# EAGLE design 192x64 (EAGLE 7.4.0)
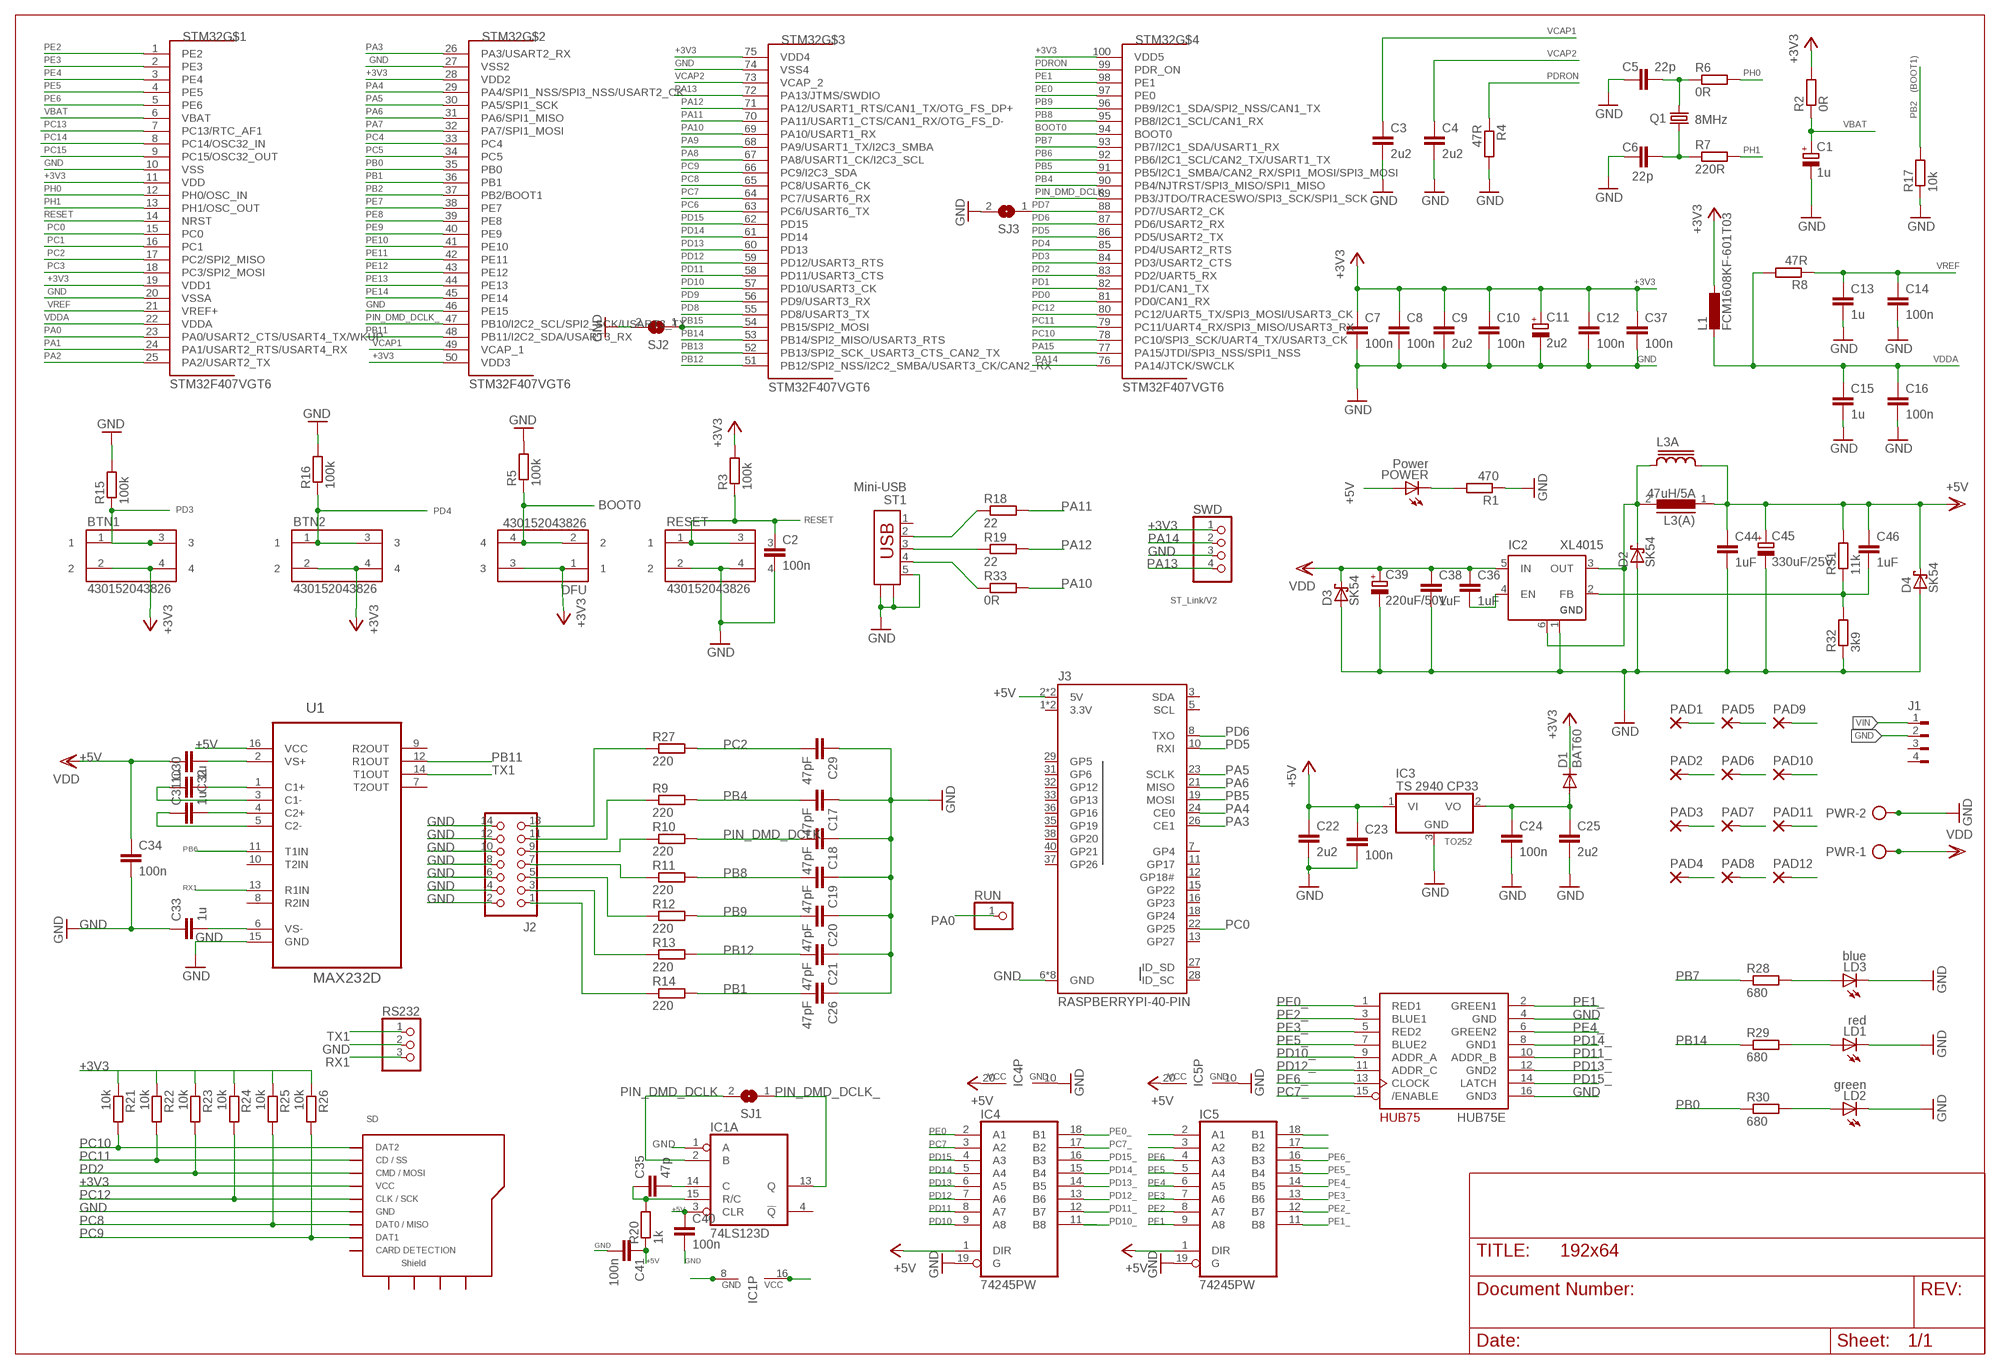
[diagram p0: schematic, sheet 1]

## Parts
BTN1  430152043826  [430152043826]
BTN2  430152043826  [430152043826]
C1  1u  CPOL-EUCT3528  [CT3528]
C2  100n  C-EUC0805  [C0805]
C3  2u2  C-EUC0805  [C0805]
C4  2u2  C-EUC0805  [C0805]
C5  22p  C-EUC0805  [C0805]
C6  22p  C-EUC0805  [C0805]
C7  100n  C-EUC0805  [C0805]
C8  100n  C-EUC0805  [C0805]
C9  2u2  C-EUC1206  [C1206]
C10  100n  C-EUC0805  [C0805]
C11  2u2  CPOL-EUCT3528  [CT3528]
C12  100n  C-EUC0805  [C0805]
C13  1u  C-EUC1206  [C1206]
C14  100n  C-EUC0805  [C0805]
C15  1u  C-EUC1206  [C1206]
C16  100n  C-EUC0805  [C0805]
C17  47pF  C-EUC0805  [C0805]
C18  47pF  C-EUC0805  [C0805]
C19  47pF  C-EUC0805  [C0805]
C20  47pF  C-EUC0805  [C0805]
C21  47pF  C-EUC0805  [C0805]
C22  2u2  C-EUC1206  [C1206]
C23  100n  C-EUC0805  [C0805]
C24  100n  C-EUC0805  [C0805]
C25  2u2  C-EUC1206  [C1206]
C26  47pF  C-EUC0805  [C0805]
C29  47pF  C-EUC0805  [C0805]
C30  1u  C-EUC0805  [C0805]
C31  1u  C-EUC0805  [C0805]
C32  1u  C-EUC0805  [C0805]
C33  1u  C-EUC0805  [C0805]
C34  100n  C-EUC0805  [C0805]
C35  47p  C-EUC0805  [C0805]
C36  1uF  C-EUC1206  [C1206]
C37  100n  C-EUC0805  [C0805]
C38  1uF  C-EUC1206  [C1206]
C39  220uF/50V  CPOL-EUG  [PANASONIC_G]
C40  100n  C-EUC0805  [C0805]
C41  100n  C-EUC0805  [C0805]
C44  1uF  C-EUC1206  [C1206]
C45  330uF/25V  CPOL-EUG  [PANASONIC_G]
C46  1uF  C-EUC1206  [C1206]
D1  BAT60  DIODE-SOD323-W  [SOD323-W]
D2  SK54  SCHOTTKY-DIODESMD  [SMB]
D3  SK54  SCHOTTKY-DIODESMD  [SMB]
D4  SK54  SCHOTTKY-DIODESMD  [SMB]
DFU  430152043826  [430152043826]
HUB75E  RGB  HUB75MATRIX  [2X08-IDC]
IC1  74LS123D  [SO16]
IC2  XL4015  [TO263-5]
IC3  TS 2940 CP33  7808DT  [TO252]
IC4  74245PW  [TSSOP20]
IC5  74245PW  [TSSOP20]
J1  FLOPPY-4  [FLOPPY-4]
J2  CON_HEADER_2X07-PTH-SHROUDED  [PINSHRD_PTH_2X07]
J3  RASPBERRYPI-40-PIN  RASPBERRYPI-40-PIN-GPIO_PTH_NO_SHROUD  [2X20]
L1  FCM1608KF-601T03  L-EUL2012C  [L2012C]
L3(A)  47uH/5A  ED16  [ED16]
L3A  SRR1206  [SRR1206]
LD1  red  LEDCHIP-LED0805  [CHIP-LED0805]
LD2  green  LEDCHIP-LED0805  [CHIP-LED0805]
LD3  blue  LEDCHIP-LED0805  [CHIP-LED0805]
PAD1  SMD5  [SMD2,54-5,08]
PAD2  SMD5  [SMD2,54-5,08]
PAD3  SMD5  [SMD2,54-5,08]
PAD4  SMD5  [SMD2,54-5,08]
PAD5  SMD5  [SMD2,54-5,08]
PAD6  SMD5  [SMD2,54-5,08]
PAD7  SMD5  [SMD2,54-5,08]
PAD8  SMD5  [SMD2,54-5,08]
PAD9  SMD5  [SMD2,54-5,08]
PAD10  SMD5  [SMD2,54-5,08]
PAD11  SMD5  [SMD2,54-5,08]
PAD12  SMD5  [SMD2,54-5,08]
POWER  Power  LEDCHIPLED_0805  [CHIPLED_0805]
PWR  AK500/2-H  [AK500/2-H]
Q1  8MHz  CRYSTALHC49UP  [HC49UP]
R1  470  R-EU_R0805  [R0805]
R2  0R  R-EU_R0805  [R0805]
R3  100k  R-EU_R0805  [R0805]
R4  47R  R-EU_R0805  [R0805]
R5  100k  R-EU_R0805  [R0805]
R6  0R  R-EU_R0805  [R0805]
R7  220R  R-EU_R0805  [R0805]
R8  47R  R-EU_R0805  [R0805]
R9  220  R-EU_R0805  [R0805]
R10  220  R-EU_R0805  [R0805]
R11  220  R-EU_R0805  [R0805]
R12  220  R-EU_R0805  [R0805]
R13  220  R-EU_R0805  [R0805]
R14  220  R-EU_R0805  [R0805]
R15  100k  R-EU_R0805  [R0805]
R16  100k  R-EU_R0805  [R0805]
R17  10k  R-EU_R0805  [R0805]
R18  22  R-EU_R0805  [R0805]
R19  22  R-EU_R0805  [R0805]
R20  1k  R-EU_R0805  [R0805]
R21  10k  R-EU_R0805  [R0805]
R22  10k  R-EU_R0805  [R0805]
R23  10k  R-EU_R0805  [R0805]
R24  10k  R-EU_R0805  [R0805]
R25  10k  R-EU_R0805  [R0805]
R26  10k  R-EU_R0805  [R0805]
R27  220  R-EU_R0805  [R0805]
R28  680  R-EU_R0805  [R0805]
R29  680  R-EU_R0805  [R0805]
R30  680  R-EU_R0805  [R0805]
R31  11k  R-EU_R1206  [R1206]
R32  3k9  R-EU_R1206  [R1206]
R33  0R  R-EU_R0805  [R0805]
RESET  430152043826  [430152043826]
RS232  PINHD-1X3  [1X03]
RUN  PINHD-1X1  [1X01]
SD  MICROSD_CARD_POLLIN  [MR**-AP*03**]
SJ1  SJ  [SJ]
SJ2  SJ  [SJ]
SJ3  SJ  [SJ]
ST1  Mini-USB  UBS-MINI  [USBMINI]
STM32  STM32F407VGT6  STM32F407VX  [LQFP100]
SWD  PINHD-1X4  [1X04]
U1  MAX232D  [SOIC127P600X175-16N]

## Nets
+3V3: BTN1.2 BTN1.4 BTN2.2 BTN2.4 C7.1 C8.1 C9.1 C10.1 C11.+ C12.1 C37.1 D1.C DFU.1 DFU.3 L1.1 R2.2 R3.2 R21.1 R22.1 R23.1 R24.1 R25.1 R26.1 SD.VCC STM32.11(VDD) STM32.19(VDD1) STM32.28(VDD2) STM32.50(VDD3) STM32.75(VDD4) STM32.100(VDD5) SWD.1
+5V: C22.1 C23.1 C32.2 C34.1 C40.1 C41.1 C44.1 C45.+ C46.1 D4.C IC1.3(A:CLR) IC1.16(P:VCC) IC3.1(VI) IC4.1(DIR) IC4.20(VCC) IC5.1(DIR) IC5.20(VCC) J3.2(5V) J3.4(5V) L3(A).1 L3A.2 PAD1.1(P) PAD2.1(P) PAD5.1(P) PAD6.1(P) PAD9.1(P) PAD10.1(P) POWER.A R20.1 R31.2 U1.16(VCC) ; supply symbol labelled VDD
BOOT0: DFU.2 DFU.4 R5.1 STM32.94(BOOT0)
GND: C1.- C2.2 C3.2 C4.2 C5.2 C6.2 C7.2 C8.2 C9.2 C10.2 C11.- C12.2 C13.2 C14.2 C15.2 C16.2 C17.1 C18.1 C19.1 C20.1 C21.1 C22.2 C23.2 C24.2 C25.2 C26.1 C29.1 C33.1 C34.2 C37.2 C38.2 C39.- C40.2 C41.2 C44.2 C45.- D2.A D3.A D4.A HUB75E.4(GND) HUB75E.16(GND3) IC1.1(A:A) IC1.8(P:GND) IC2.1(GND) IC3.3(GND) IC4.10(GND) IC4.19(G) IC5.2(A1) IC5.3(A2) IC5.10(GND) IC5.19(G) J1.2 J2.2 J2.4 J2.6 J2.8 J2.10 J2.12 J2.14 J3.6(GND) J3.9(GND) J3.14(GND) J3.20(GND) J3.25(GND) J3.30(GND) J3.34(GND) J3.39(GND) LD1.C LD2.C LD3.C PAD3.1(P) PAD4.1(P) PAD7.1(P) PAD8.1(P) PAD11.1(P) PAD12.1(P) PWR.2 R1.1 R4.2 R5.2 R15.2 R16.2 R17.1 R32.1 RESET.2 RESET.4 RS232.2 SD.GND SJ2.2 SJ3.2 ST1.5 ST1.N1 ST1.N2 STM32.10(VSS) STM32.20(VSSA) STM32.27(VSS2) STM32.46(PE15) STM32.74(VSS4) SWD.3 U1.15(GND)
N$1: C5.1 Q1.2 R6.1
N$2: C6.1 Q1.1 R7.1
N$3: POWER.C R1.2
N$4: J2.13 R27.1
N$5: J2.11 R9.1
N$6: J2.9 R10.1
N$7: J2.7 R11.1
N$8: J2.5 R12.1
N$9: J2.3 R13.1
N$10: C35.1 IC1.15(A:R/C) R20.2
N$11: J2.1 R14.1
N$12: C24.1 C25.1 D1.A IC3.2(VO)
N$13: C30.2 U1.1(C1+)
N$14: C30.1 U1.3(C1-)
N$15: C31.2 U1.4(C2+)
N$16: C31.1 U1.5(C2-)
N$17: C33.2 U1.6(VS-)
N$18: C32.1 U1.2(VS+)
N$19: LD1.A R29.2
N$20: D2.C IC2.3(OUT) IC2.6(TAB) L3(A).2 L3A.1
N$21: C46.2 IC2.2(FB) R31.1 R32.2
N$22: C35.2 IC1.14(A:C)
N$23: LD3.A R28.2
N$24: C36.2 IC2.4(EN)
N$25: R33.1 ST1.4
N$26: LD2.A R30.2
N$39: R19.1 ST1.3
N$40: R18.1 ST1.2
N$62: IC5.18(B1)
N$63: IC5.17(B2)
PA0: RUN.1 STM32.23(PA0/USART2_CTS/USART4_TX/WKUP)
PA1: STM32.24(PA1/USART2_RTS/USART4_RX)
PA2: STM32.25(PA2/USART2_TX)
PA3: J3.26(CE1) STM32.26(PA3/USART2_RX)
PA4: J3.24(CE0) STM32.29(PA4/SPI1_NSS/SPI3_NSS/USART2_CK)
PA5: J3.23(SCLK) STM32.30(PA5/SPI1_SCK)
PA6: J3.21(MISO) STM32.31(PA6/SPI1_MISO)
PA7: STM32.32(PA7/SPI1_MOSI)
PA8: STM32.67(PA8/USART1_CK/I2C3_SCL)
PA9: STM32.68(PA9/USART1_TX/I2C3_SMBA)
PA10: R33.2 STM32.69(PA10/USART1_RX)
PA11: R18.2 STM32.70(PA11/USART1_CTS/CAN1_RX/OTG_FS_D-)
PA12: R19.2 STM32.71(PA12/USART1_RTS/CAN1_TX/OTG_FS_DP+)
PA13: STM32.72(PA13/JTMS/SWDIO) SWD.4
PA14: STM32.76(PA14/JTCK/SWCLK) SWD.2
PA15: STM32.77(PA15/JTDI/SPI3_NSS/SPI1_NSS)
PB0: R30.1 STM32.35(PB0)
PB1: C26.2 R14.2 STM32.36(PB1)
PB2: R17.2 STM32.37(PB2/BOOT1)
PB4: C17.2 R9.2 STM32.90(PB4/NJTRST/SPI3_MISO/SPI1_MISO)
PB5: J3.19(MOSI) STM32.91(PB5/I2C1_SMBA/CAN2_RX/SPI1_MOSI/SPI3_MOSI)
PB6: STM32.92(PB6/I2C1_SCL/CAN2_TX/USART1_TX) U1.11(T1IN)
PB7: R28.1 STM32.93(PB7/I2C1_SDA/USART1_RX)
PB8: C19.2 R11.2 STM32.95(PB8/I2C1_SCL/CAN1_RX)
PB9: C20.2 R12.2 STM32.96(PB9/I2C1_SDA/SPI2_NSS/CAN1_TX)
PB11: STM32.48(PB11/I2C2_SDA/USART3_RX) U1.12(R1OUT)
PB12: C21.2 R13.2 STM32.51(PB12/SPI2_NSS/I2C2_SMBA/USART3_CK/CAN2_RX)
PB13: STM32.52(PB13/SPI2_SCK_USART3_CTS_CAN2_TX)
PB14: R29.1 STM32.53(PB14/SPI2_MISO/USART3_RTS)
PB15: SJ2.1 STM32.54(PB15/SPI2_MOSI)
PC0: J3.22(GP25) STM32.15(PC0)
PC1: STM32.16(PC1)
PC2: C29.2 R27.2 STM32.17(PC2/SPI2_MISO)
PC3: STM32.18(PC3/SPI2_MOSI)
PC4: STM32.33(PC4)
PC5: STM32.34(PC5)
PC6: STM32.63(PC6/USART6_TX)
PC7: IC4.3(A2) STM32.64(PC7/USART6_RX)
PC7_: HUB75E.15(/ENABLE) IC4.17(B2)
PC8: R25.2 SD.DAT0(DAT0/MISO) STM32.65(PC8/USART6_CK)
PC9: R26.2 SD.DAT1 STM32.66(PC9/I2C3_SDA)
PC10: R21.2 SD.DAT2 STM32.78(PC10/SPI3_SCK/UART4_TX/USART3_CK)
PC11: R22.2 SD.DAT3/CS(CD/SS) STM32.79(PC11/UART4_RX/SPI3_MISO/USART3_RX)
PC12: R24.2 SD.CLK(CLK/SCK) STM32.80(PC12/UART5_TX/SPI3_MOSI/USART3_CK)
PC13: STM32.7(PC13/RTC_AF1)
PC14: STM32.8(PC14/OSC32_IN)
PC15: STM32.9(PC15/OSC32_OUT)
PD0: STM32.81(PD0/CAN1_RX)
PD1: STM32.82(PD1/CAN1_TX)
PD2: R23.2 SD.CMD(CMD/MOSI) STM32.83(PD2/UART5_RX)
PD3: BTN1.1 BTN1.3 R15.1 STM32.84(PD3/USART2_CTS)
PD4: BTN2.1 BTN2.3 R16.1 STM32.85(PD4/USART2_RTS)
PD5: J3.10(RXI) STM32.86(PD5/USART2_TX)
PD6: J3.8(TXO) STM32.87(PD6/USART2_RX)
PD7: SJ3.1 STM32.88(PD7/USART2_CK)
PD8: STM32.55(PD8/USART3_TX)
PD9: STM32.56(PD9/USART3_RX)
PD10: IC4.9(A8) STM32.57(PD10/USART3_CK)
PD10_: HUB75E.9(ADDR_A) IC4.11(B8)
PD11: IC4.8(A7) STM32.58(PD11/USART3_CTS)
PD11_: HUB75E.10(ADDR_B) IC4.12(B7)
PD12: IC4.7(A6) STM32.59(PD12/USART3_RTS)
PD12_: HUB75E.11(ADDR_C) IC4.13(B6)
PD13: IC4.6(A5) STM32.60(PD13)
PD13_: HUB75E.12(GND2) IC4.14(B5)
PD14: IC4.5(A4) STM32.61(PD14)
PD14_: HUB75E.8(GND1) IC4.15(B4)
PD15: IC4.4(A3) STM32.62(PD15)
PD15_: HUB75E.14(LATCH) IC4.16(B3)
PDRON: R4.1 STM32.99(PDR_ON)
PE0: IC4.2(A1) STM32.97(PE0)
PE0_: HUB75E.1(RED1) IC4.18(B1)
PE1: IC5.9(A8) STM32.98(PE1)
PE1_: HUB75E.2(GREEN1) IC5.11(B8)
PE2: IC5.8(A7) STM32.1(PE2)
PE2_: HUB75E.3(BLUE1) IC5.12(B7)
PE3: IC5.7(A6) STM32.2(PE3)
PE3_: HUB75E.5(RED2) IC5.13(B6)
PE4: IC5.6(A5) STM32.3(PE4)
PE4_: HUB75E.6(GREEN2) IC5.14(B5)
PE5: IC5.5(A4) STM32.4(PE5)
PE5_: HUB75E.7(BLUE2) IC5.15(B4)
PE6: IC5.4(A3) STM32.5(PE6)
PE6_: HUB75E.13(CLOCK) IC5.16(B3)
PE7: STM32.38(PE7)
PE8: STM32.39(PE8)
PE9: STM32.40(PE9)
PE10: STM32.41(PE10)
PE11: STM32.42(PE11)
PE12: STM32.43(PE12)
PE13: STM32.44(PE13)
PE14: STM32.45(PE14)
PH0: R6.2 STM32.12(PH0/OSC_IN)
PH1: R7.2 STM32.13(PH1/OSC_OUT)
PIN_DMD_DCLK: C18.2 IC1.2(A:B) R10.2 SJ1.2
PIN_DMD_DCLK_: IC1.13(A:Q) SJ1.1 STM32.47(PB10/I2C2_SCL/SPI2_SCK/USART3_TX) STM32.89(PB3/JTDO/TRACESWO/SPI3_SCK/SPI1_SCK)
RESET: C2.1 R3.1 RESET.1 RESET.3 STM32.14(NRST)
RX1: RS232.3 U1.13(R1IN)
TX1: RS232.1 U1.14(T1OUT)
VBAT: C1.+ R2.1 STM32.6(VBAT)
VCAP1: C3.1 STM32.49(VCAP_1)
VCAP2: C4.1 STM32.73(VCAP_2)
VDDA: C15.1 C16.1 L1.2 R8.2 STM32.22(VDDA)
VIN: C36.1 C38.1 C39.+ D3.C IC2.5(IN) J1.1 PWR.1 ; supply symbol labelled VDD
VREF: C13.1 C14.1 R8.1 STM32.21(VREF+)
Unconnected: IC1.4(A:!Q) IC1.5(B:Q) IC1.6(B:C) IC1.7(B:R/C) IC1.9(B:A) IC1.10(B:B) IC1.11(B:CLR) IC1.12(B:!Q) J1.3 J1.4 J3.3(SDA) J3.5(SCL) J3.7(GP4) J3.11(GP17) J3.12(GP18#) J3.13(GP27) J3.15(GP22) J3.16(GP23) J3.18(GP24) J3.27(ID_SD) J3.28(ID_SC) J3.29(GP5) J3.31(GP6) J3.32(GP12) J3.33(GP13) J3.35(GP19) J3.36(GP16) J3.37(GP26) J3.38(GP20) J3.40(GP21) SD.CARD_DETECTION(CARD_D) SD.SHD_1(SHD1) SD.SHD_2(SHD2) SD.SHD_3(SHD3) SD.SHD_4(SHD4) ST1.1 U1.7(T2OUT) U1.8(R2IN) U1.9(R2OUT) U1.10(T2IN)

## Notes on the sheet
- (BOOT1)
- ST_Link/V2
- TO252

## Power pins joined to a net without a drawn wire
3.3V: J3.1(3.3V) J3.17(3.3V)

## Library data of the parts
BTN1 BTN2 DFU RESET = Switches_rev16a:430152043826: WS-TSS-6x6 mm SMD Tact Switch,4 pins
C1 C11 = rcl:CPOL-EU: POLARIZED CAPACITOR, European symbol
C2 C5-C8 C10 C12 C16 C23 C24 C37 = rcl:C-EU: CAPACITOR, European symbol
C3 C4 C9 C13-C15 C17-C22 C25 C26 C29-C36 C38 C40 C41 C44 C46 = resistor:C-EU: CAPACITOR, European symbol
C39 C45 = resistor:CPOL-EU: POLARIZED CAPACITOR, European symbol
D1 = diode:DIODE-: DIODE
D2-D4 = diode:SCHOTTKY-DIODE: Schottky Diode
HUB75E = adafruit:HUB75MATRIX
IC1 = 74xx-eu:74*123: Retriggerable monostable MULTIVIBRATOR
IC2 = linear4:XL4015
IC3 = linear:78*: Positive VOLTAGE REGULATOR Source: http://cache.national.com/ds/LM/LM78L05.pdf http://www.fairchildsemi.com/ds/LM/LM7805.pdf
IC4 IC5 = 74xx-eu:74*245: Octal BUS TRANSCEIVER, 3-state
J1 = con-amp:FLOPPY-4: MATE N-LOCK Floppy / HDD conector Distributor: Bürklin 71F970
J2 = dp_devices.v6:CON_HEADER_2X07: 2x07 pin header
J3 = SparkFun-Connectors:RASPBERRYPI-40-PIN-GPIO: Raspberry Pi GPIO Header 2x20 pin connector, as found on B, B+, A+ models. Both shrouded PTH and SMT versions available. SparkFun Products: GPIO Shrouded Header <https://www.sparkfun.com/products/13054>- PTH SparkFun Pi Wedge (Preassembled) <https://www.sparkfun.com/products/13717>
L1 = rcl:L-EU: INDUCTOR, European symbol
L3(A) = inductors:ED16: INDUCTOR
L3A = inductor-bourns:SRR1206: POWER INDUCTOR
LD1-LD3 = adafruit:LED: LED
PAD1-PAD12 = wirepad:SMD5: SMD PAD
POWER = led:LED: LED
PWR = con-ptr500:AK500/2-H: CONNECTOR Aug. 2004 / PTR Meßtechnik: Die Bezeichnung der Serie AK505 wurde geändert. Es handelt sich hierbei um AK500 in horizontaler Ausführung.; OC_FARNELL: unknown; OC_NEWARK: unknown
Q1 = crystal:CRYSTAL: CRYSTAL; OC_FARNELL: unknown; OC_NEWARK: unknown
R1 R2 R4 R6-R8 R17 R20 = rcl:R-EU_: RESISTOR, European symbol
R3 R5 R9-R16 R18 R19 R21-R33 = resistor:R-EU_: RESISTOR, European symbol
RS232 = pinhead:PINHD-1X3: PIN HEADER
RUN = pinhead:PINHD-1X1: PIN HEADER
SD = 000_eigene_Bauteile:MICROSD_CARD_POLLIN
SJ1-SJ3 = jumper:SJ: SMD solder JUMPER
ST1 = con-amp:UBS-MINI
STM32 = STM32F407Vx_LQFP100:STM32F407VX: STmicroelectronics Cortex M4 Series Typ: STM32F407Vx LQFP100 Copyright 2012 by Ersan Günes, Quantitec, info@quantitec.de
SWD = pinhead:PINHD-1X4: PIN HEADER
U1 = MAX232D:MAX232D: DUAL EIA-232 DRIVERS/RECEIVERS

## Board
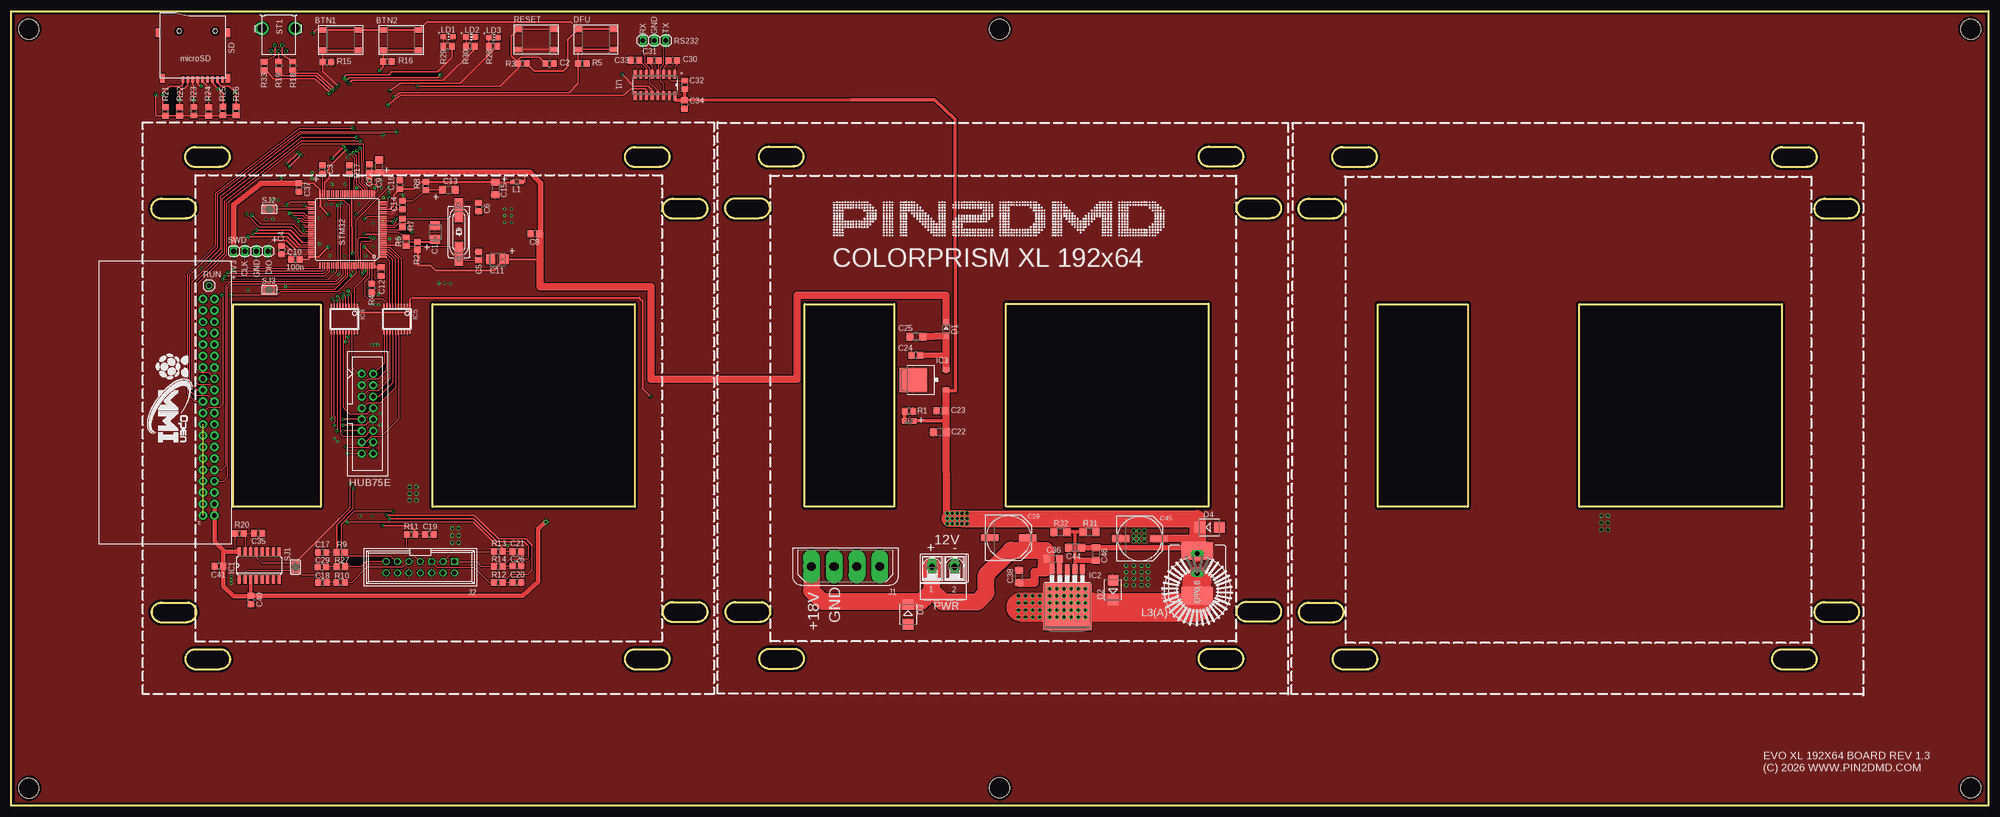
[diagram p1: board, top side]
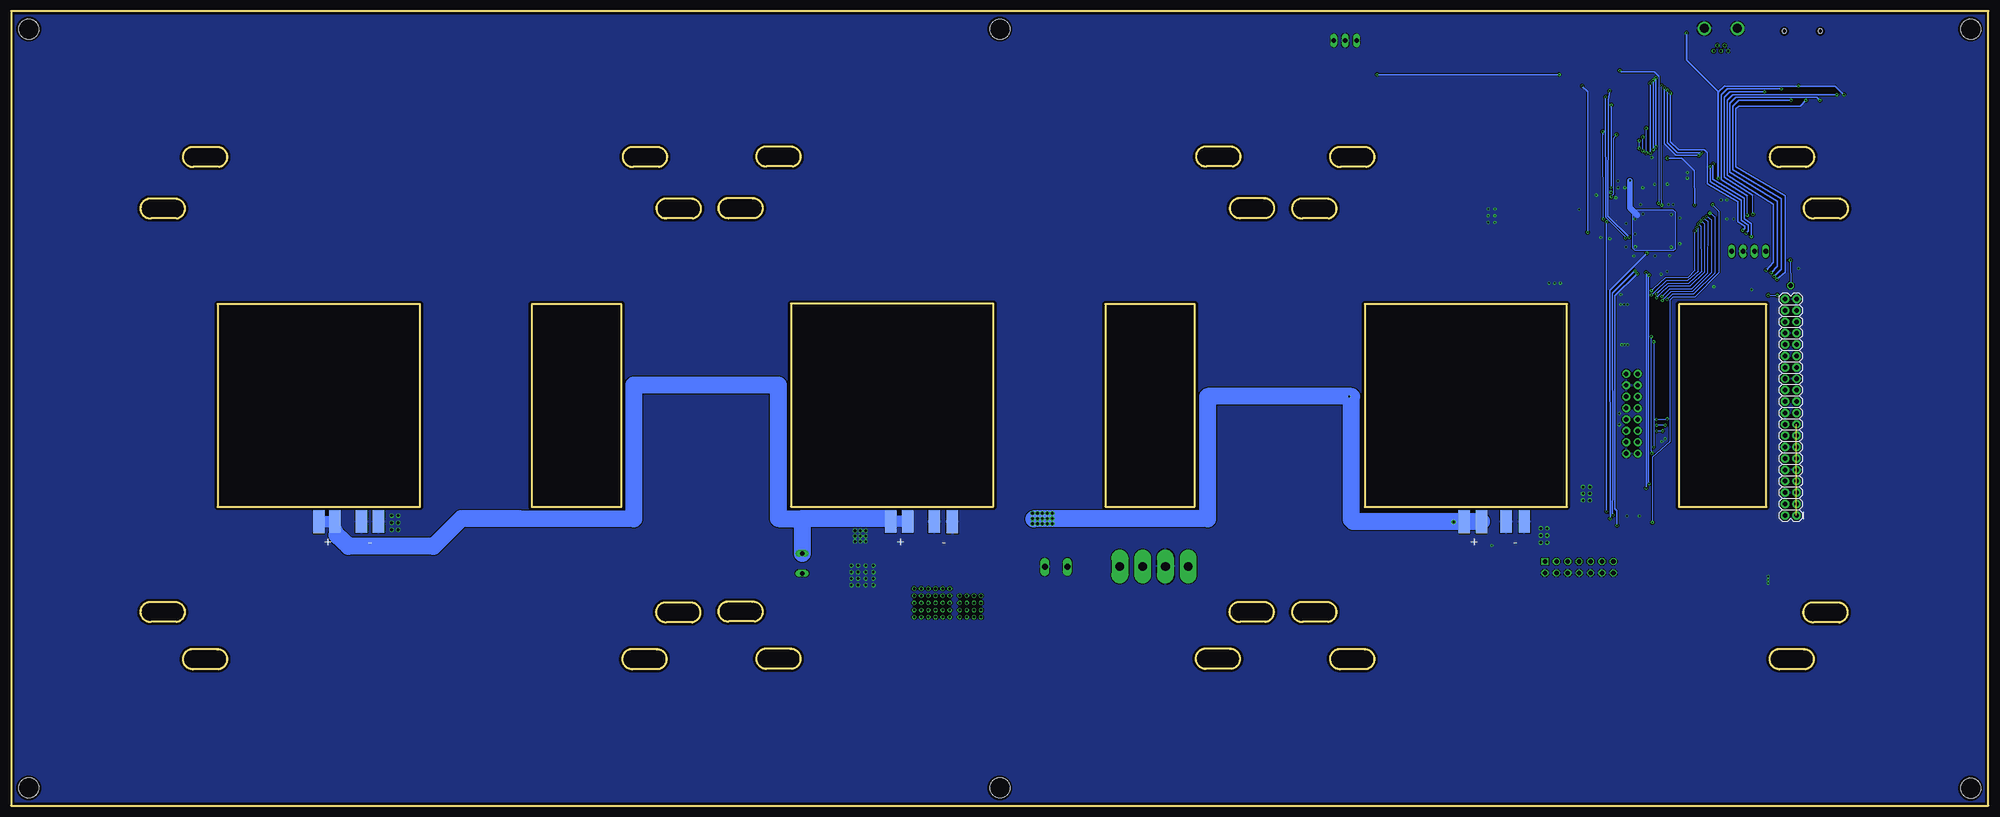
[diagram p2: board, bottom side, seen from below]

Size 441.07 x 177.19 mm. Coordinates in mm from the lower left corner, seen from the top.
Outline: 144 segments
Copper layers (1*16): Top 0.035mm / dielectric 1.6mm / Bottom 0.035mm
Design rules "Elecrow_2-layer_PCB_eagle_rule *": minimum track width 6mil, minimum drill 12mil, track to track 8mil, track to pad 6mil, pad to pad 6mil, via to via 8mil, smd to smd 0mil, copper to edge 20mil, drill to drill 10mil, minimum pad ring 6mil, minimum via ring 6mil, stop-mask expansion 0mil, vias tented up to drill 100mil, thermal gap 10mil
Holes 4.5 mm at 3.95,173.19 220.51,173.19 437.15,173.19 437.15,3.96 220.51,3.96 3.95,3.88

### Footprints (pad centres in the part's own frame; a part is rotated, then mirrored left to right if it is on the bottom)
430152043826 = smd 1.55 x 1.3: 1 -3.975,2.25; 2 -3.975,-2.25; 3 3.975,2.25; 4 3.975,-2.25
CT3528 = smd 2 x 2.2: + -1.5,0; - 1.5,0
C0805 = smd 1.3 x 1.5: 1 -0.95,0; 2 0.95,0
C1206 = smd 1.6 x 1.8: 1 -1.4,0; 2 1.4,0
PANASONIC_G = smd 3.9 x 1.6: + 4.25,0; - -4.25,0
SOD323-W = smd 1.5 x 1.2: A 1.45,0; C -1.45,0
SMB = smd 2.4 x 2.4: A 2.2,0; C -2.2,0
2X08-IDC = drill 1 pad 1.778: 1 -1.27,8.89; 2 1.27,8.89; 3 -1.27,6.35; 4 1.27,6.35; 5 -1.27,3.81; 6 1.27,3.81; 7 -1.27,1.27; 8 1.27,1.27; 9 -1.27,-1.27; 10 1.27,-1.27; 11 -1.27,-3.81; 12 1.27,-3.81; 13 -1.27,-6.35; 14 1.27,-6.35; 15 -1.27,-8.89; 16 1.27,-8.89
SO16 = smd 0.66 x 2.032: 1 -4.445,-3.073; 2 -3.175,-3.073; 3 -1.905,-3.073; 4 -0.635,-3.073; 5 0.635,-3.073; 6 1.905,-3.073; 7 3.175,-3.073; 8 4.445,-3.073; 9 4.445,3.073; 10 3.175,3.073; 11 1.905,3.073; 12 0.635,3.073; 13 -0.635,3.073; 14 -1.905,3.073; 15 -3.175,3.073; 16 -4.445,3.073
TO263-5 = smd 1.067 x 2.159: 1 -3.404,-5.791; 2 -1.702,-5.791; 3 0,-5.791; 4 1.702,-5.791; 5 3.404,-5.791 | smd 10.8 x 10.41: 6 0,2.54
TO252 = smd 1 x 1.6: 1 -2.28,-4.8; 2 2.28,-4.8 | smd 5.4 x 6.2: 3 0,2.5
TSSOP20 = smd 0.305 x 0.991: 1 -2.925,-2.918; 2 -2.275,-2.918; 3 -1.625,-2.918; 4 -0.975,-2.918; 5 -0.325,-2.918; 6 0.325,-2.918; 7 0.975,-2.918; 8 1.625,-2.918; 9 2.275,-2.918; 10 2.925,-2.918; 11 2.925,2.918; 12 2.275,2.918; 13 1.625,2.918; 14 0.975,2.918; 15 0.325,2.918; 16 -0.325,2.918; 17 -0.975,2.918; 18 -1.625,2.918; 19 -2.275,2.918; 20 -2.925,2.918
FLOPPY-4 = drill 1.93 pad 3.81 long: 1 7.62,0; 2 2.54,0; 3 -2.54,0; 4 -7.62,0
PINSHRD_PTH_2X07 = drill 1.016 square: 1 -7.62,-1.27 | drill 1.016 octagon: 2 -7.62,1.27; 3 -5.08,-1.27; 4 -5.08,1.27; 5 -2.54,-1.27; 6 -2.54,1.27; 7 0,-1.27; 8 0,1.27; 9 2.54,-1.27; 10 2.54,1.27; 11 5.08,-1.27; 12 5.08,1.27; 13 7.62,-1.27; 14 7.62,1.27
2X20 = drill 1.016 pad 1.88: 1 0,0; 2 0,2.54; 3 2.54,0; 4 2.54,2.54; 5 5.08,0; 6 5.08,2.54; 7 7.62,0; 8 7.62,2.54; 9 10.16,0; 10 10.16,2.54; 11 12.7,0; 12 12.7,2.54; 13 15.24,0; 14 15.24,2.54; 15 17.78,0; 16 17.78,2.54; 17 20.32,0; 18 20.32,2.54; 19 22.86,0; 20 22.86,2.54; 21 25.4,0; 22 25.4,2.54; 23 27.94,0; 24 27.94,2.54; 25 30.48,0; 26 30.48,2.54; 27 33.02,0; 28 33.02,2.54; 29 35.56,0; 30 35.56,2.54; 31 38.1,0; 32 38.1,2.54; 33 40.64,0; 34 40.64,2.54; 35 43.18,0; 36 43.18,2.54; 37 45.72,0; 38 45.72,2.54; 39 48.26,0; 40 48.26,2.54
L2012C = smd 1 x 1: 1 -1,0; 2 1,0
ED16 = drill 1.016 long: 1 -8.255,0; 2 -3.81,0
SRR1206 = smd 4 x 7: 1 -5,0; 2 5,0
CHIP-LED0805 = smd 1.2 x 1.2: A 0,-1.05; C 0,1.05
SMD2,54-5,08 = smd 2.54 x 5.08: 1 0,0
CHIPLED_0805 = smd 1.2 x 1.2: A 0,-1.05; C 0,1.05
AK500/2-H = drill 1.321 long: 1 -2.515,0; 2 2.515,0
HC49UP = smd 5.334 x 1.93: 1 -4.826,0; 2 4.826,0
R0805 = smd 1.3 x 1.5: 1 -0.95,0; 2 0.95,0
R1206 = smd 1.6 x 1.803: 1 -1.422,0; 2 1.422,0
1X03 = drill 1.016 long: 1 -2.54,0; 2 0,0; 3 2.54,0
1X01 = drill 1.016 octagon: 1 0,0
MR**-AP*03** = smd 0.6 x 1.5: CARD_DETECTION -6.55,0.3; CLK -2.15,0.3; CMD 0.05,0.3; DAT0 -4.35,0.3; DAT1 -5.45,0.3; DAT2 2.25,0.3; DAT3/CS 1.15,0.3; GND -3.25,0.3; VCC -1.05,0.3 | smd 1 x 2: SHD_1 -7.85,0; SHD_2 6.85,0; SHD_3 -7.85,-10.1; SHD_4 7.85,-10.1 | hole 1: -4.95,-10.5; 3.05,-10.5
SJ = smd 1.168 x 1.6: 1 -0.762,0; 2 0.762,0
USBMINI = drill 0.5: 1 -1.6,3; 2 -0.8,1.8; 3 0,3; 4 0.8,1.8; 5 1.6,3 | drill 2: N1 -3.7,-2; N2 3.7,-2
LQFP100 = smd 1.5 x 0.4: 1 -8,6.075; 25 -8,-6.075; 51 8,-6.075; 75 8,6.075 | smd 1.5 x 0.25: 2 -8,5.5; 3 -8,5; 4 -8,4.5; 5 -8,4; 6 -8,3.5; 7 -8,3; 8 -8,2.5; 9 -8,2; 10 -8,1.5; 11 -8,1; 12 -8,0.5; 13 -8,0; 14 -8,-0.5; 15 -8,-1; 16 -8,-1.5; 17 -8,-2; 18 -8,-2.5; 19 -8,-3; 20 -8,-3.5; 21 -8,-4; 22 -8,-4.5; 23 -8,-5; 24 -8,-5.5; 52 8,-5.5; 53 8,-5; 54 8,-4.5; 55 8,-4; 56 8,-3.5; 57 8,-3; 58 8,-2.5; 59 8,-2; 60 8,-1.5; 61 8,-1; 62 8,-0.5; 63 8,0; 64 8,0.5; 65 8,1; 66 8,1.5; 67 8,2; 68 8,2.5; 69 8,3; 70 8,3.5; 71 8,4; 72 8,4.5; 73 8,5; 74 8,5.5 | smd 0.4 x 1.5: 26 -6.075,-8; 50 6.075,-8; 76 6.075,8; 100 -6.075,8 | smd 0.25 x 1.5: 27 -5.5,-8; 28 -5,-8; 29 -4.5,-8; 30 -4,-8; 31 -3.5,-8; 32 -3,-8; 33 -2.5,-8; 34 -2,-8; 35 -1.5,-8; 36 -1,-8; 37 -0.5,-8; 38 0,-8; 39 0.5,-8; 40 1,-8; 41 1.5,-8; 42 2,-8; 43 2.5,-8; 44 3,-8; 45 3.5,-8; 46 4,-8; 47 4.5,-8; 48 5,-8; 49 5.5,-8; 77 5.5,8; 78 5,8; 79 4.5,8; 80 4,8; 81 3.5,8; 82 3,8; 83 2.5,8; 84 2,8; 85 1.5,8; 86 1,8; 87 0.5,8; 88 0,8; 89 -0.5,8; 90 -1,8; 91 -1.5,8; 92 -2,8; 93 -2.5,8; 94 -3,8; 95 -3.5,8; 96 -4,8; 97 -4.5,8; 98 -5,8; 99 -5.5,8
1X04 = drill 1.016 long: 1 -3.81,0; 2 -1.27,0; 3 1.27,0; 4 3.81,0
SOIC127P600X175-16N = smd 2.057 x 0.61: 1 -4.801,8.89; 2 -4.801,7.62; 3 -4.801,6.35; 4 -4.801,5.08; 5 -4.801,3.81; 6 -4.801,2.54; 7 -4.801,1.27; 8 -4.801,0; 9 0,0; 10 0,1.27; 11 0,2.54; 12 0,3.81; 13 0,5.08; 14 0,6.35; 15 0,7.62; 16 0,8.89

### Placement (x,y rotation side)
BTN1  73.47,170.75 180 top
BTN2  86.96,170.75 180 top
C1  94.57,127.82 90 top
C2  120.13,165.51 0 top
C3  69.43,141.9 90 top
C4  60.3,123.9 270 top
C5  104.27,122.58 90 top
C6  104.29,133.55 270 top
C7  79.92,142.14 90 top
C8  116.83,127.57 180 top
C9  82.06,142.6 90 top
C10  63.41,121.86 180 top
C11  108.5,121.83 180 top
C12  82.53,119.1 270 top
C13  97.64,137.34 0 top
C14  87.27,133.96 270 top
C15  108.02,137.63 270 top
C16  86.72,138.5 90 top
C17  69.38,56.49 0 top
C18  69.41,49.77 0 top
C19  93.3,60.5 180 top
C20  112.83,49.77 180 top
C21  112.83,56.62 180 top
C22  207.19,83.28 180 top
C23  207.36,88.07 180 top
C24  201.83,100.45 180 top
C25  201.89,104.63 180 top
C26  112.79,53.48 180 top
C29  69.34,53.24 0 top
C30  147.59,166.22 0 top
C31  143.49,166.22 0 top
C32  150.27,160.8 270 top
C33  139.2,166.24 0 top
C34  150.19,156.38 270 top
C35  55.09,60.75 0 top
C36  232.49,55.09 0 top
C37  64.18,137.84 270 top
C38  224.83,51.14 90 top
C39  222.51,59.77 0 top
C40  53.47,45.86 270 top
C41  46.35,53.41 180 top
C44  237.31,57.49 180 top
C45  251.78,59.6 0 top
C46  242.01,56.13 270 top
D1  208.58,106.31 270 top
D2  245.82,48.09 90 top
D3  200.1,42.69 270 top
D4  267.33,62.08 0 top
DFU  130.44,170.91 0 top
HUB75E  79.5,87.41 0 top
IC1  55.32,53.56 0 top
IC2  235.59,46.92 180 top
IC3  203.76,94.96 90 top
IC4  74.33,108.58 180 top
IC5  86.08,108.58 180 top
J1  186.11,53.35 180 top
J2  91.27,53.17 180 top
J3  42.81,64.74 90 bottom
L1  112.86,139.08 180 top
L3(A)  264.63,47.99 270 top
L3A  264.58,51.83 90 top
LD1  97.45,171.5 270 top
LD2  102.52,171.43 270 top
LD3  107.58,171.37 270 top
PAD1  116.92,63.3 0 bottom
PAD2  113.07,63.33 0 bottom
PAD3  107.53,63.37 0 bottom
PAD4  103.51,63.37 0 bottom
PAD5  244.86,63.4 0 bottom
PAD6  241.07,63.4 0 bottom
PAD7  235.12,63.36 0 bottom
PAD8  231.1,63.35 0 bottom
PAD9  368.84,63.36 0 bottom
PAD10  372.45,63.34 0 bottom
PAD11  362.9,63.36 0 bottom
PAD12  359.12,63.36 0 bottom
POWER  200.35,85.83 90 top
PWR  207.95,53.26 0 top
Q1  99.88,127.96 270 top
R1  200.28,87.96 180 top
R2  90.64,124.82 270 top
R3  114.09,165.51 0 top
R4  80.47,115.46 270 top
R5  127.43,165.51 0 top
R6  88.1,125.77 90 top
R7  87.28,129.92 270 top
R8  92.48,138.17 90 top
R9  73.56,56.5 180 top
R10  73.5,49.75 180 top
R11  89.22,60.5 0 top
R12  108.72,49.77 0 top
R13  108.69,56.68 0 top
R14  108.68,53.41 0 top
R15  70.45,165.83 0 top
R16  83.94,165.99 0 top
R17  75.43,141.88 270 top
R18  62.8,165.03 270 top
R19  59.69,165.03 270 top
R20  50.91,60.71 0 top
R21  34.4,154.81 90 top
R22  37.59,154.81 90 top
R23  40.78,154.88 90 top
R24  44.04,154.85 90 top
R25  47.22,154.9 90 top
R26  50.21,154.97 90 top
R27  73.53,53.27 180 top
R28  107.51,169.36 180 top
R29  97.37,169.38 180 top
R30  102.4,169.36 180 top
R31  240.57,61.01 0 top
R32  234.06,61.01 0 top
R33  56.43,164.99 270 top
RESET  117.11,170.91 0 top
RS232  143.49,170.65 180 top
RUN  44.11,115.99 0 top
SD  40.55,162.25 180 top
SJ1  63.41,53.21 270 top
SJ2  57.57,133 180 top
SJ3  57.58,115.08 180 top
ST1  59.65,171.34 180 top
STM32  74.96,128.5 180 top
SWD  53.45,123.65 0 top
U1  139.18,158.34 270 top

### Tracks (layer width: path | path; a pad name or v marks a point on that pad's centre or on a via)
3.3V  (1 unrouted)
+3V3  (via drill 0.3, 0.35)
  Top 0.254: 90.66,120.6 90.77,120.49 | STM32.19 79.49,131.49 v78.83,130.83 | STM32.28 79.97,134.87 v77.03,131.93 | C8.1 117.88,127.57 117.95,127.5 | 62.03,138.78 61.85,138.96 60.2,138.96
  Top 0.305: STM32.11 78.79,127.5 78.8,127.5 v78.81,127.5 | 79.96,140.95 C7.1 | v32.22,158.58 32.22,154.14 32.49,153.86 R21.1 R22.1 | 41.74,162.39 41.74,162.09 SD.VCC 41.6,161.06 42.16,160.5 42.36,160.5 v42.38,160.49 | R22.1 | R22.1 40.71,153.86 R23.1 44.02,153.93 R24.1 47.17,153.9 R25.1 50.14,153.95 R26.1 | DFU.1 DFU.3
  Top 0.406: C10.1 66.4,121.86 STM32.75 68.62,122.42 v70.73,124.53 | R2.2 90.66,120.6 | 90.77,120.49 93.48,120.49 94.53,119.44 107.81,119.44 C11.+ 117.95,121.83 | C12.1 81.47,120.05 81.47,120.06 STM32.100 81.03,122.33 v78.73,124.63 | 82.29,141.22 C9.1 | 64.09,138.69 C37.1 | DFU.3 127.56,173.16 | v70.73,131.83 68.88,133.68 STM32.50 68.88,137.38 67.5,138.75 C37.1 | 64.22,138.83 C37.1 | 117.96,132.06 118.13,132.23 | 83.5,141.25 83.53,141.22 | 114.53,141.22 114.63,141.12 114.63,139.13 114.56,139.06 113.86,139.06 L1.1 | v60.2,139.92 60.2,138.96 | v67.33,172.33 68,173 BTN1.4 BTN1.2 BTN2.4 BTN2.2 92.81,174.88 124.75,174.88 DFU.1 124.09,170.79 124.09,164.84 123.08,163.83 116.73,163.83 R3.2
  Top 1.27: 79.96,140.95 79.96,139.46 v79.93,139.43 | 82.29,141.22 83.53,141.22 114.53,141.22 115.74,141.22 118.13,138.83 118.13,132.23 118.13,127.92 C8.1 | C9.1 C7.1 | C37.1 62.03,138.78 55.78,138.78 55.58,138.58 49.64,133.99 SWD.1
  Top 1.676: D1.C 208.58,113.83 175.34,113.83 175.34,95.08 142.8,95.08 142.8,115.75 117.94,115.75 117.94,121.74 117.95,121.83 117.95,127.5
  Bottom 0.254: v70.73,124.53 70.73,124.63 | 70.13,123.83 69.73,124.23 69.73,132.33 70.23,132.83 78.83,132.83 79.43,132.23 79.43,124.43 78.83,123.83 70.13,123.83
  Bottom 0.305: 58.89,160.49 v42.38,160.49 34.12,160.49 v32.22,158.58
  Bottom 0.406: v60.2,139.92 60.2,159.18 | 60.2,159.18 58.89,160.49 | v67.33,172.33 67.33,166.31 60.2,159.18
  Bottom 1.27: v79.93,139.43 79.93,133.33 78.33,131.73
  pour Bottom: 69.73,132.33 70.23,132.83 78.83,132.83 79.43,132.23 79.43,124.43 78.83,123.83 70.13,123.83 69.73,124.23
+5V  (via drill 0.3, 0.6, 0.6 pad 1.02)
  Top 0.152: 47.33,53.46 C41.1 | R20.1 | C23.1 208.33,88.08 208.58,88.08
  Top 0.254: IC1.16 49.96,57.55 R20.1 | v208.83,65.23 v209.93,65.23 | v209.93,65.23 v211.03,65.23 | v209.93,64.03 v211.03,64.03 v211.03,62.89 | v209.93,64.03 v208.83,64.04 v208.83,62.89 v209.93,62.89 | v209.93,64.03 209.83,64.06 v209.93,65.23 | v209.93,65.23 208.85,64.83 208.62,64.96
  Top 0.305: 50.88,56.58 IC1.16
  Top 0.406: IC5.20 89.01,110.83 | 89.01,110.83 IC5.1 89.01,113.01 89.58,113.33 140.08,113.33 140.83,112.58 140.83,93.02 v142.58,91.27 | IC4.20 IC4.1 77.26,110.66 77.83,110.08 88.26,110.08 89.01,110.83
  Top 0.813: POWER.A 208.58,85.83 | C40.1 53.47,50.48 IC1.3 | C34.1 187.52,157.4 205.96,157.4 210.58,153.04 210.65,92.54 208.56,92.54 IC3.1 | C34.1 148.07,157.33 U1.16 | C34.1 150.27,157.33 C32.2 | 53.32,46.65 C40.1 | v119.25,63.3 119.28,63.3 | 54.35,46.78 C40.1
  Top 1.016: 50.88,56.58 47.58,56.58 | 47.58,56.58 47.33,56.58 47.33,53.46 47.33,48.95 49.62,46.65 53.32,46.65 | 119.28,63.3 117.58,61.8 117.58,49.95 114.15,46.78 54.35,46.78 | 47.58,56.58 45.35,58.81 J3.2 J3.4
  Top 1.27: L3A.2 264.63,56.83 L3(A).1 | C44.1 238.71,57.53 C46.1 264.58,57.53 264.58,58.08 264.63,58.08 264.63,58.33 264.63,63.26 242.08,63.26 | 242.01,63.26 242.08,63.26 | R31.2 242.08,61.01 242.08,63.26 | D4.C 264.61,62.08 264.61,63.08 | v211.03,65.23 v212.13,65.23 v213.23,65.23 | v213.23,64.03 213.23,64.08 v212.12,64.03 212.13,64.08 v212.13,62.89
  Top 1.676: 208.62,64.96 C22.1 208.58,85.83 208.58,88.08 208.58,88.33 IC3.1 | C45.+ 264.63,59.6 264.63,59.33
  Top 3.81: 209.34,64.06 209.83,64.06 | L3(A).1 264.63,58.33 264.63,59.33 264.61,63.08 264.61,64.02 v212.12,64.03 v209.93,64.03
  Bottom 0.152: 142.08,68.46 142.11,63.84
  Bottom 0.254: 212.96,63.96 v213.23,64.03 | v208.83,64.04 v209.93,65.23 v209.93,64.03 v208.83,65.23 | 264.58,64.03 264.58,64.06
  Bottom 0.305: 142.11,63.84 120.9,63.84 v119.25,63.3
  Bottom 1.016: 245.35,64.02 244.86,64.02 PAD5.1
  Bottom 1.27: PAD2.1 PAD1.1 | 264.58,63.4 264.58,56.08 | 264.58,63.4 PAD6.1 252.58,63.4 252.58,64.08 | 264.58,63.4 264.58,63.83 | 212.96,63.96 213.23,63.96 v213.23,62.89
  Bottom 2.54: 244.88,62.77 PAD5.1 PAD6.1 | 368.43,60.33 368.63,61.26 368.08,60.91 368.88,62.2 PAD9.1 371.63,63.36 PAD10.1
  Bottom 3.81: 212.96,63.96 174.16,63.96 174.16,91.27 v142.58,91.27 142.07,91.27 142.11,63.84 141.65,63.37 PAD2.1 | 368.43,60.33 365.83,57.83 346.83,57.83 340.66,64 340.66,64.02 327.75,64.01 302.17,63.88 302.17,93.77 269.92,93.81 269.9,64.03 264.63,64.03 | 259.73,64.02 245.77,64.02 245.35,64.02 | 259.73,64.02 264.27,63.99 264.58,64.03 264.63,64.03 | 259.73,64.02 264.63,64.01 L3(A).1 264.63,64.03
BOOT0  (via drill 0.3)
  Top 0.254: STM32.94 77.97,122.03 77.97,125.47 78.33,125.83 80.15,125.83 v80.95,126.63
  Top 0.305: 124.52,159.06 124.41,159.06 | 124.41,159.06 86.67,159.06 85.63,158.25 v85.38,158.06 | DFU.2 DFU.4 DFU.2 R5.1 126.48,161.12 124.41,159.06
  Bottom 0.254: 85.36,131.27 80.98,126.85 80.98,126.66 v80.95,126.63
  Bottom 0.305: 85.36,131.27 v85.38,158.06
GND  (via drill 0.3, 0.6, 0.6 pad 0.25)
  Top 0.254: STM32.74 61.87,123 C4.2 | STM32.20 85.04,132 86.01,132.97 87.23,132.97 C14.2
  Top 0.305: RESET.2 RESET.4
  other vias: 80.48,102.78 81.11,102.78 81.75,102.78 87.46,136.14 91.27,132.97 84.43,126.46 86.44,126.69 110.74,58.04 98.4,61.84 98.4,60.26 99.83,61.84 99.83,60.26 98.4,58.67 99.83,58.67 354.76,64.69 354.76,63.11 356.19,64.69 356.19,63.11 354.76,61.52 356.19,61.52 49.11,51.14 49.11,50.38 49.11,49.61 250.43,61.33 251.63,61.33 252.83,61.33 250.43,60.13 251.63,60.13 252.83,60.13 250.43,58.93 251.63,58.93 252.83,58.93 248.73,53.53 250.43,53.53 252.13,53.53 248.73,52.08 250.43,52.08 252.13,52.08 248.73,50.63 250.43,50.63 252.13,50.63 248.73,49.18 250.43,49.18 252.13,49.18 71.58,138.58 74.43,138.59 75.08,144.58 67.14,141.22 67.14,139.95 77.08,137.83 82.58,139.33 82.58,137.83 83.08,135.58 80.83,129.83 80.83,124.58 59.58,135.08 56.83,130.83 58.33,130.83 68.83,131.08 68.83,125.33 70.33,134.08 71.33,134.08 77.58,134.08 74.33,122.58 79.08,122.58 72.08,81.83 72.83,81.23 77.83,64.58 80.58,64.58 253.63,53.53 253.63,52.08 253.63,50.63 253.63,49.18 88.9,71.09 88.9,69.59 88.9,68.09 90.4,68.09 90.4,69.59 90.4,71.09 110.08,133.08 111.58,133.08 110.08,131.58 111.58,131.58 110.08,130.08 111.58,130.08 81.98,114.03 81.98,111.78 81.23,111.78 80.48,111.78 95.48,116.53 96.73,116.53 97.98,116.53 82.33,87.48 82.33,84.98 52.83,115.08 58.33,135.08 61.22,115.72 72.99,118.53 71.63,119.16 71.13,122.66 81.08,137.83 84.18,136.79 42.32,119.82
  pour Bottom: 0.79,176.55 440.43,176.55 440.59,0.63 0.63,0.63
  pour Top: 0.64,176.65 0.64,0.73 440.61,0.73 440.45,176.42 0.7,176.58 0.7,176.65
N$1
  Top 0.254: R6.1 97.88,124.81 Q1.2 101.26,121.63 C5.1
N$2
  Top 0.254: R7.1 97.5,130.87 Q1.1 100.27,134.64 C6.1
N$3
  Top 0.813: POWER.C 199.3,87.96 R1.2
N$4
  Top 0.254: J2.13 79.21,54.44 78.02,53.26 74.49,53.26 R27.1
N$5
  Top 0.254: J2.11 86.08,54.44 84.76,55.63 75.25,55.63 R9.1
N$6
  Top 0.254: J2.9 88.65,54.44 87.33,53.12 79.28,53.12 75.91,49.76 R10.1
N$7
  Top 0.254: J2.7 88.27,57.44 R11.1
N$8
  Top 0.254: J2.5 95.06,53.19 103.32,53.19 106.74,49.77 R12.1
N$9
  Top 0.254: J2.3 98.59,56.68 R13.1
N$10
  Top 0.152: 54.08,60.71 C35.1 | 52.21,56.71 IC1.15 | 52.21,60.71 51.96,60.71 R20.2 52.21,60.71
  Top 0.254: IC1.15 52.15,60.65 52.21,60.71 52.25,60.75 C35.1
N$11
  Top 0.254: J2.1 98.95,54.38 103.91,54.38 104.88,53.41 R14.1
N$12
  Top 1.27: C24.1 208.57,100.45
  Top 1.676: IC3.2 208.57,100.45 D1.A C25.1
N$13
  Top 0.254: C30.2 148.54,165.24 148.09,164.8 148.09,163.17 U1.1
N$14
  Top 0.254: C30.1 146.64,165.67 145.51,164.55 145.51,163.15 U1.3
N$15
  Top 0.254: C31.2 144.44,165.18 144.26,165 U1.4
N$16
  Top 0.254: C31.1 142.54,165.46 143.01,165 143.01,163.16 U1.5
N$17
  Top 0.254: C33.2 140.15,166.14 141.75,164.53 141.75,163.18 U1.6
N$18
  Top 0.152: 150.21,161.83 C32.1
  Top 0.254: U1.2 146.8,162.13 147.23,161.69 150.21,161.69 C32.1
N$19
  Top 0.254: LD1.A 96.4,169.4 R29.2
N$20  (via drill 0.6 pad 0.25)
  Top 0.406: L3A.1 260.07,45.33 264.58,46.71
  Top 0.813: v236.45,46.81 235.68,47.58 235.58,47.58 235.58,47.52 v234.87,46.81 | v236.45,45.22 236.45,44.74 236.13,44.43 236.45,44.11 v236.45,43.63 | IC2.6 235.7,44.38 v236.45,43.63 | 235.58,45.96 235.58,45.93 v234.87,45.22 | 235.48,44.27 235.48,44.24 v234.87,43.63 | v234.87,42.04 v234.87,43.63 | v234.87,45.22 v233.28,46.81 | v233.28,46.81 v231.69,48.39 v231.69,46.81 v231.69,45.22 v231.69,43.63 v231.69,42.04 v233.28,42.04 v233.28,43.63 v233.28,45.22 v233.28,46.81 | v233.28,48.39 v233.28,46.81 | v236.45,48.39 v234.87,48.39 v234.87,46.81 | v234.87,46.81 v234.87,45.22 | v234.87,45.22 v234.87,43.63 | v234.87,43.63 234.87,41.89 236.29,41.89 v236.45,42.04 v236.45,43.63 | v236.45,43.63 v236.45,46.81 | v236.45,46.81 v236.45,48.39 | v236.45,48.39 v238.04,48.39 v238.04,46.81 v238.04,45.22 v239.63,45.22 | v238.04,43.63 v238.04,42.04 v239.63,42.04 v239.63,43.63 v239.63,45.22 | v239.63,45.22 v239.63,46.81 v239.63,48.39 | v227.88,45.22 v226.3,45.22 v226.3,46.81 | v226.3,46.81 v227.88,46.81 v229.47,46.81 v229.47,45.22 | v229.47,42.04 v229.47,43.63 v227.88,43.63 | v227.88,43.63 v227.88,42.04 | v227.88,43.63 v226.3,43.63 v226.3,42.04 | v224.71,43.63 v224.71,42.04 | v224.71,46.81 v226.3,46.81
  Top 1.27: 235.58,49.08 235.58,47.58 | IC2.3 235.58,49.19 | 235.58,49.19 235.58,49.08 | 235.58,45.96 IC2.6 | L3(A).2 264.58,50.11 | D2.C 241.13,44.28 | v236.45,48.39 236.37,48.39 235.58,49.19 | 234.71,48.39 v234.87,48.39 235.55,49.08 235.58,49.08 | v226.3,43.63 v224.71,45.22 224.87,45.22 | v224.71,43.63 225.2,44.12 225.2,44.28 224.87,44.61 224.87,45.22 | 224.87,45.22 v226.3,45.22 | 224.87,45.22 226.45,43.63
  Top 1.93: 235.58,45.96 235.58,49.08
  Top 6.452: 235.58,45.96 236.05,44.28 | 264.58,50.11 264.58,46.71 264.6,44.28 241.13,44.28 225.2,44.28 225.18,44.27 235.48,44.27 IC2.6
N$21
  Top 0.813: 237.32,52.53 237.32,61.06 | 237.32,61.06 239.15,61.06 R31.1 | 237.32,61.06 235.48,61.06 R32.2 | 237.32,52.53 237.33,54.71 237.83,54.71 | IC2.2 237.32,52.53
  Top 1.27: C46.2 237.83,54.71
N$22
  Top 0.254: IC1.14 53.45,56.67 53.45,58.01 56.04,60.6 C35.2
N$23
  Top 0.254: LD3.A 106.53,169.4 R28.2
N$24
  Top 1.27: C36.2 IC2.4
N$25
  Top 0.305: ST1.4 58.85,167.26 R33.1
N$26
  Top 0.254: LD2.A 101.47,169.42 R30.2
N$39
  Top 0.305: ST1.3 59.65,166.35 R19.1
N$40
  Top 0.305: ST1.2 60.45,167.45 R18.1
PA0  (via drill 0.35)
  Top 0.254: STM32.23 83.75,133.5 84.08,133.83 v84.08,135.83 | v44.15,121.67 46.58,124.08 46.58,135.83 64.58,149.83 82.83,149.83 v82.94,149.67
  Bottom 0.254: v84.08,135.83 83.52,136.53 83.55,148.83 v82.94,149.67 | v44.15,121.67 RUN.1
PA3
  Top 0.254: J3.26 45.35,95.35 44.19,96.51 42.15,96.51 41.33,97.33 41.37,116.21 48.09,122.82 48.08,134.33 64.83,147.58 78.58,147.58 78.57,139.41 79.56,138.44 81.61,138.45 81.83,138.23 81.83,137.29 STM32.26
PA4  (via drill 0.35)
  Top 0.254: J3.24 45.35,92.81 44.23,93.93 41.73,93.93 40.83,94.83 40.84,116.53 47.59,123.23 47.58,134.83 64.83,148.33 v77.83,148.33 | STM32.29 79.46,137.8 78.08,139.18 78.08,146.08 v77.83,146.58
  Bottom 0.254: v77.83,146.58 v77.83,148.33
PA5  (via drill 0.35)
  Top 0.254: J3.23 41.48,92.68 40.33,93.83 40.33,116.83 47.08,123.58 47.08,135.33 64.83,149.08 v77.08,149.08 | STM32.30 78.96,137.55 77.58,138.93 77.58,145.58 v77.08,146.08
  Bottom 0.254: v77.08,146.08 v77.08,149.08
PA6  (via drill 0.35)
  Top 0.254: J3.21 41.02,90.14 39.33,91.83 39.33,118.58 45.58,124.83 45.58,136.58 64.33,151.08 v76.33,151.08 | STM32.31 78.46,137.35 77.08,138.73 77.08,144.83 v76.33,145.58
  Bottom 0.254: v76.33,145.58 v76.33,151.08
PA10  (via drill 0.3, 0.35)
  Top 0.254: STM32.69 64.98,125.5
  Top 0.305: v70.95,158.9 70.9,159.22 67.67,162.13 58.48,162.13 57.21,163.72 R33.2 | 64.98,125.5 63.08,127.6 62.4,128.34 v54.82,128.34
  Bottom 0.305: v70.95,158.9 70.95,148.12 69.04,146.3 63.33,146.3 62.7,145.67 62.7,138.75 55.91,134.67 55.91,130.27 54.36,129.2 54.37,128.75 54.78,128.34 v54.82,128.34
PA11  (via drill 0.3, 0.35)
  Top 0.254: STM32.70 64.39,125
  Top 0.305: v64.6,145.03 v62.06,142.49 | v72.27,160.06 71.87,160.17 68.3,163.4 63.55,163.4 62.91,164.04 R18.2 | 64.39,125 61.92,127.7 56.68,127.7 v54.04,127.69
  Bottom 0.305: v72.27,160.06 72.22,147.57 69.68,145.03 v64.6,145.03 | v62.06,142.49 62.03,139.13 55.13,135.03 55.13,130.53 53.53,129.43 53.52,128.24 v54.04,127.69
PA12  (via drill 0.3, 0.35)
  Top 0.254: 66.77,124.49 63.89,124.49
  Top 0.305: v63.97,145.67 v61.43,143.13 | v71.59,159.53 71.54,159.53 67.99,162.77 60.69,162.77 R19.2 | 66.77,124.49 STM32.71 | 63.89,124.49 61.6,126.93 55.93,126.92 v52.87,126.91
  Bottom 0.305: v71.59,159.53 71.59,147.89 69.36,145.67 v63.97,145.67 | v61.43,143.13 61.43,139.73 54.43,135.43 54.43,130.88 52.85,129.81 v52.87,126.91
PA13
  Top 0.254: 63.5,124 66.89,124 STM32.72 | SWD.4 57.26,124.99 58.25,125.98
  Top 0.305: 58.25,125.98 61.5,125.98 63.5,124
PA14
  Top 0.254: STM32.76 68.88,120.25 68.88,119.79 61.1,119.8 61.02,119.79 53.37,119.79 52.08,121.08 52.08,123.56 SWD.2
PB0  (via drill 0.35)
  Top 0.254: STM32.35 76.46,139.46 76.58,139.58 76.58,144.37 v75.4,145.55
  Top 0.305: v75.4,161.12 76.03,161.76 96.35,161.76 103.35,168.76 R30.1
  Bottom 0.305: v75.4,145.55 v75.4,161.12
PB1  (via drill 0.3)
  Top 0.254: C26.2 111.77,53.41 R14.2 111.26,55.04 115.27,55.04 115.47,55.24 115.47,57.88 115.14,58.21 | 75.96,135.02 STM32.36
  Top 0.305: 75.96,135.02 76.02,123.34 76.18,123.18 v76.19,123.18 | v84.37,64 103.21,63.97 108.42,58.89 114.46,58.89 115.14,58.21
  Bottom 0.305: v76.19,123.18 84.38,114.91 84.37,65.14 v84.37,64
PB2
  Top 0.254: STM32.37 75.46,140.9 R17.2
PB4  (via drill 0.3)
  Top 0.254: R9.2 72.6,56.49 C17.2 | STM32.90 75.96,119.27 v76.32,118.9 | 72.61,62.58 76.34,66.31 v76.34,70.81
  Top 0.305: 72.61,62.58 R9.2
  Bottom 0.305: v76.32,118.9 v76.34,70.81
PB5  (via drill 0.35)
  Top 0.254: STM32.91 76.46,119.7 77.08,119.08 77.08,118.83 72.83,114.58 60.08,114.58 59.33,113.83 v49.08,113.83 | J3.19 42.85,87.6 44.08,88.83 46.58,88.83 47.33,89.58 47.33,113.58 47.21,113.71 v47.08,113.83
  Bottom 0.254: v49.08,113.83 v47.08,113.83
PB6  (via drill 0.3)  (1 unrouted)
  Top 0.254: STM32.92 76.96,130.62 77.02,130.72 83.73,137.43 v84.15,137.85
  Top 0.305: U1.11 141.72,159.57 141.44,159.85 138.26,159.85 136.67,158.42 86.83,158.45 86.27,157.98 86.23,157.95 v84.1,156.3
  Bottom 0.254: 84.15,137.9 84.18,137.87
  Bottom 0.305: 84.15,137.9 v84.1,156.3
PB7  (via drill 0.3)
  Top 0.254: STM32.93 77.45,124.2 77.45,126.45 77.77,126.77 80.09,126.77 v80.12,126.8
  Top 0.305: v84.46,159.42 86.8,161.12 100.16,161.12 108.4,169.36 R28.1
  Bottom 0.305: v80.12,126.8 84.84,131.49 84.79,156.56 84.78,157.35 v84.46,159.42
PB8  (via drill 0.3)
  Top 0.254: C19.2 92.33,60.5 R11.2 | v78.32,118.62 78.23,118.58 78.23,119.48 78.46,119.73 STM32.95
  Top 0.305: R11.2 90.17,61.34 89.06,62.46 83.91,62.46 v82.85,62.46
  Bottom 0.305: v78.32,118.62 78.57,118.36 83.32,113.71 83.28,66.24 83.29,66.24 82.85,65.8 v82.85,62.46
PB9  (via drill 0.3)
  Top 0.254: C20.2 R12.2 111.5,51.61 115.27,51.61 116.19,52.53 116.19,57.95 | v78.86,119.25 78.96,119.44 STM32.96
  Top 0.305: v83.72,64.8 103.3,64.82 108.72,59.53 114.77,59.52 116.19,58.09 116.19,57.95
  Bottom 0.305: v83.72,64.8 83.84,65.27 83.81,70.89 83.85,114.31 v78.86,119.25
PB11  (via drill 0.3, 0.35)
  Top 0.305: STM32.48 69.96,138.96 70.95,139.95 70.95,142.49 v74.76,146.3 | v74.76,161.76 75.4,162.39 95.08,162.39 v95.72,163.03 | v136.36,163.03 138.9,160.49 142.07,160.49 142.99,159.57 U1.12
  Bottom 0.305: v74.76,146.3 v74.76,161.76 | v95.72,163.03 v136.36,163.03
PB12  (via drill 0.3)
  Top 0.254: C21.2 111.81,56.68 R13.2 | STM32.51 62.07,134.57 v61.53,134.03 | 103.15,63.19 82.46,63.19 v74.95,63.19
  Top 0.305: 103.15,63.19 108.34,58.05 108.54,57.91 109.17,57.91 109.64,57.45 R13.2
  Bottom 0.254: v61.53,134.03 60.13,132.53 60.13,118.83 65.48,113.43 70.33,113.43 71.03,112.73 71.03,81.13 74.97,77.69 v74.95,63.19
PB14  (via drill 0.3, 0.35)
  Top 0.305: STM32.53 65.98,133.5 v65.51,133.96 | R29.1 98.32,166.9 95.08,163.66 84.92,163.66 84.29,163.03 74.76,163.03 v74.13,162.39 | v74.13,146.94 v71.59,144.4
  Bottom 0.305: v74.13,162.39 v74.13,146.94 | v71.59,144.4 68.41,144.4 65.53,141.58 v65.51,133.96
PB15
  Top 0.254: STM32.54 SJ2.1
PC0  (via drill 0.35)
  Top 0.254: J3.22 45.27,90.14 44,91.41 41.06,91.39 39.83,92.58 39.83,118.33 46.08,124.58 46.08,136.33 64.33,150.33 v86.02,150.32 | STM32.15 85.29,129.5 85.85,130.11 v85.85,130.84
  Bottom 0.254: v85.85,130.84 85.96,149.58 | 85.96,149.58 v86.02,150.32 85.96,149.58
PC2  (via drill 0.3)  (1 unrouted)
  Top 0.254: C29.2 72.55,53.24 R27.2 72.77,53.52 73.58,54.33 73.58,62.63 73.57,62.64 73.57,62.67 76.51,65.61 85.12,65.61 v85.14,65.59 | 82.97,130.48 84.93,130.48 v85.17,130.24
  Bottom 0.305: v85.17,130.24 85.18,66.11 85.17,66.11 85.17,65.87 v85.14,65.59
PC7  (via drill 0.3)
  Top 0.254: STM32.64 66.94,127.99 65.95,128 65.77,128.19 v65.38,128.19 | IC4.3 75.96,114.11 v75.17,114.86
  Bottom 0.254: v65.38,128.19 65.43,127.85 65.43,119.43 67.08,117.78 72.03,117.78 74.78,115.25 | 74.78,115.25 v75.17,114.86 75.19,114.83 74.78,115.25
PC7_  (via drill 0.3)
  Top 0.254: 75.33,105.66 IC4.17 75.33,105.64 75.33,104.74 v75.19,104.6 | HUB75E.15 75.14,78.52 v75.08,78.58
  Bottom 0.254: v75.19,104.6 75.19,104.21 75.25,104.15 75.25,79.16 75.08,78.99 v75.08,78.58
PC8  (via drill 0.3, 0.35)
  Top 0.254: STM32.65 65.14,127.5 62.91,129.73 55.63,129.73 v53.77,131.69
  Top 0.305: SD.DAT0 44.9,161.11 46.17,159.84 | 46.17,159.84 47.24,158.77 47.24,155.87 R25.2 | v46.19,159.85 46.17,159.84
  Bottom 0.254: v53.77,131.69 53.79,135.99
  Bottom 0.305: 53.79,135.99 59.53,139.63 59.52,158.58 58.25,159.85 v46.19,159.85
PC9  (via drill 0.3, 0.35)
  Top 0.254: STM32.66 64.61,127.02 62.59,129.13 55.18,129.13 v52.54,131.88
  Top 0.305: SD.DAT1 46,161.31 46.02,161.31 46.85,160.48 48.67,160.48 v49.94,159.22 50.22,158.93 R26.2
  Bottom 0.254: v52.54,131.88 52.54,136.19
  Bottom 0.305: 52.54,136.19 58.93,140.13 58.89,157.95 57.62,159.22 v49.94,159.22
PC10  (via drill 0.3, 0.35)
  Top 0.254: STM32.78 69.96,119.54 69.44,119.17 49.83,119.17
  Top 0.305: 49.83,119.17 v49.57,119.45 | SD.DAT2 38.3,160.85 37.93,160.49 35.31,160.49 33.79,158.97 v33.79,158.58 33.79,155.79 R21.2
  Bottom 0.305: v49.57,119.45 47.94,121.15 47.94,134.12 58.25,140.59 58.25,157.31 56.98,158.58 v33.79,158.58
PC11  (via drill 0.3, 0.35)
  Top 0.254: STM32.79 70.46,120.43 70.46,119.31 69.57,118.64 48.74,118.64
  Top 0.305: 48.74,118.64 v48.43,118.89 | SD.DAT3/CS 39.4,160.68 38.57,159.85 38.08,159.85 37.58,159.35 v37.58,157.31 R22.2
  Bottom 0.305: v48.43,118.89 47.05,120.27 47.05,134.76 57.62,141.22 57.62,156.68 56.35,157.95 38.22,157.95 v37.58,157.31
PC12  (via drill 0.3, 0.35)
  Top 0.254: STM32.80 70.96,119.08 69.77,118.05 v47.75,118.05
  Top 0.305: SD.CLK 42.7,161.45 44.02,160.13 v44.02,157.31 44.02,155.82 R24.2
  Bottom 0.305: v47.75,118.05 46.17,119.63 46.17,135.39 56.98,141.86 56.98,156.04 55.71,157.31 v44.02,157.31
PD2  (via drill 0.3, 0.35)
  Top 0.254: STM32.83 72.45,120.43 72.45,118.93 70.59,117.33 v47.14,117.39
  Top 0.305: SD.CMD 40.5,160.82 40.71,160.61 v40.71,157.31 40.71,155.89 R23.2
  Bottom 0.305: v47.14,117.39 45.28,119 45.28,136.03 56.35,142.49 56.35,155.41 55.71,156.04 41.98,156.04 v40.71,157.31
PD3  (via drill 0.3)
  Top 0.254: STM32.84 72.96,133.85 v72.85,133.92
  Top 0.305: v72.87,160.64 72.68,160.72 69.5,163.84 R15.1 | BTN1.3 | BTN1.1 BTN1.3 | R15.1 | R15.1 BTN1.3
  Bottom 0.254: v72.87,160.64 72.93,160.41 72.94,160.09 72.96,134.99 72.96,134.09 v72.85,133.92
PD4  (via drill 0.3)
  Top 0.254: 73.47,120.54 73.47,134.26 v73.57,134.36
  Top 0.305: 73.47,120.54 73.46,120.54 STM32.85 | v82.2,163.97 82.98,164.75 R16.1 | BTN2.1 BTN2.3 R16.1 | R16.1
  Bottom 0.254: 73.49,162.67 73.47,134.61 73.47,134.47 v73.57,134.36
  Bottom 0.305: v82.2,163.97 v82.2,163.96 81.9,163.66 74.48,163.65 73.49,162.67
PD5
  Top 0.254: STM32.86 73.96,118.46 72.33,116.83 48.83,116.83 47.83,115.83 47.83,75.83 46.83,74.83 45.42,74.83 J3.10
PD6
  Top 0.254: STM32.87 74.46,118.21 72.58,116.33 49.08,116.33 48.33,115.58 48.33,73.33 47.36,72.36 J3.8
PD7
  Top 0.254: STM32.88 74.96,117.96 72.08,115.08 SJ3.1
PD10  (via drill 0.3)
  Top 0.254: STM32.57 65.94,131.5 65.94,131.52 65.33,132.13 v62.13,132.13 | IC4.9 72.06,112.51 v71.63,112.93
  Bottom 0.254: v62.13,132.13 62.03,132.13 61.03,131.33 61.03,118.73 65.78,114.03 70.53,114.03 v71.63,112.93
PD10_  (via drill 0.3)
  Top 0.254: IC4.11 71.41,86.5 v71.62,86.27 | HUB75E.9 v74.03,86.14
  Bottom 0.254: v74.03,86.14 71.77,86.14 v71.62,86.27
PD11  (via drill 0.3)
  Top 0.254: 66.99,130.99 STM32.58 65.72,131 65.16,131.54 62.93,131.53 v62.83,131.43 | v72.73,112.68 72.73,111.52 IC4.8
  Bottom 0.254: v62.83,131.43 61.83,130.73 61.83,118.83 65.98,114.63 70.83,114.63 72.73,112.73 v72.73,112.68
PD11_  (via drill 0.3)
  Top 0.254: 72.08,105.66 IC4.12 72.08,105.64 72.08,86.83 72.22,86.69 72.22,85.57 72.08,85.43 v72.08,84.83 | HUB75E.10 80.39,86.14 79.08,84.83 v74.02,84.83
  Bottom 0.254: v72.08,84.83 v74.02,84.83
PD12  (via drill 0.3)
  Top 0.254: STM32.59 66.98,130.5 65.43,130.51 65,130.94 v63.51,130.94 | IC4.7 73.36,113.01 v72.83,113.53
  Bottom 0.254: v63.51,130.94 63.38,130.94 62.53,130.33 62.63,119.23 62.63,118.73 66.28,115.23 71.13,115.23 v72.83,113.53
PD12_  (via drill 0.3)
  Top 0.254: IC4.13 v72.7,83.62 v72.69,83.61 | HUB75E.11 75.1,83.6 v74.02,83.57
  Bottom 0.254: v74.02,83.57 72.72,83.58 v72.69,83.61
PD13  (via drill 0.3)
  Top 0.254: STM32.60 67.02,130 66.03,130 65.34,130 65.28,130 64.93,130.33 v64.1,130.33 | IC4.6 74.01,113.26 v74.01,113.29
  Bottom 0.254: v64.1,130.33 63.93,130.33 63.33,129.83 63.33,118.93 66.58,115.83 71.43,115.83 73.01,114.26 v74.01,113.29
PD13_
  Top 0.254: IC4.14 73.38,105.66 73.38,83.03 74.08,82.33 78.83,82.33 80.1,83.6 HUB75E.12
PD14  (via drill 0.3)
  Top 0.254: STM32.61 66.02,129.49 65.62,129.49 65.45,129.49 65.25,129.49 64.85,129.71 v64.63,129.71 | IC4.5 74.66,113.51 v74.03,114.13
  Bottom 0.254: v64.63,129.71 64.61,129.71 64.03,129.13 63.92,119.22 66.86,116.43 71.63,116.44 72.69,115.42 | 72.69,115.42 v74.03,114.13 73.98,114.13 72.69,115.42
PD14_
  Top 0.254: IC4.15 74.03,105.66 74.03,88.88 74.08,88.83 74.46,88.46 75.58,87.33 79.33,87.33 80.68,88.68 HUB75E.8
PD15  (via drill 0.3)
  Top 0.254: STM32.62 66.97,128.99 65.03,128.99 v64.97,128.95 | IC4.4 75.31,113.76 v75.16,113.89
  Bottom 0.254: v64.97,128.95 64.74,128.77 64.73,119.23 67.18,117.03 71.78,117.03 74.26,114.77 | 74.26,114.77 v75.16,113.89 74.6,114.43 74.26,114.77
PD15_  (via drill 0.3)
  Top 0.254: 74.68,105.66 IC4.16 74.65,105.02 74.58,104.95 74.58,104.08 74.63,104.03 v74.63,103.46 | HUB75E.14 80.77,81.02 79.58,79.83 74.83,79.83 v74.64,80.02
  Bottom 0.254: v74.63,103.46 v74.64,80.02
PDRON
  Top 0.254: STM32.99 80.46,116.42 R4.1
PE0
  Top 0.254: STM32.97 79.46,118.36 78.22,117.12 76.61,115.51 IC4.2
PE0_
  Top 0.254: IC4.18 75.95,97.87 77.52,96.3 HUB75E.1
PE1
  Top 0.254: STM32.98 79.95,120.45 79.95,117.81 78.88,116.73 78.88,113.78 79.58,113.08 82.83,113.08 83.83,112.08 83.83,111.52 IC5.9
PE1_
  Top 0.254: IC5.11 83.16,98.69 HUB75E.2
PE2
  Top 0.254: STM32.1 83.35,122.5 84.46,121.39 IC5.8
PE2_
  Top 0.254: IC5.12 83.81,97.06 81.83,95.08 79.54,95.08 HUB75E.3
PE3
  Top 0.254: STM32.2 83.84,123 84.16,122.67 85.11,121.73 IC5.7
PE3_
  Top 0.254: IC5.13 84.46,95.21 81.83,92.58 79.58,92.58 HUB75E.5
PE4
  Top 0.254: STM32.3 84.13,123.5 84.63,123 85.76,121.87 IC5.6
PE4_
  Top 0.254: IC5.14 85.11,94.36 81.99,91.24 80.78,91.24 HUB75E.6
PE5
  Top 0.254: STM32.4 84.36,124 86.41,121.95 IC5.5
PE5_
  Top 0.254: IC5.15 85.76,93.26 82.37,89.87 79.67,89.87 79.63,89.83 79.62,89.83 HUB75E.7
PE6
  Top 0.254: STM32.5 84.52,124.5 87.06,121.96 IC5.4
PE6_
  Top 0.254: IC5.16 86.41,86.16 82.58,82.33 80.33,82.33 79.08,81.08 78.24,81.08 HUB75E.13
PH0
  Top 0.254: STM32.12 86.08,128 R6.2
PH1
  Top 0.254: STM32.13 86.8,128.5 R7.2
PIN_DMD_DCLK
  Top 0.254: R10.2 72.52,49.77 C18.2 68.79,51.34 64.88,51.34 63.77,52.45 SJ1.2 52.65,52.45 52.07,51.87 52.07,50.56 IC1.2
PIN_DMD_DCLK_  (via drill 0.3)
  Top 0.254: SJ1.1 63.33,54.05 56.1,54.05 54.69,55.46 IC1.13 | 70.46,135.3 70.47,135.3 | 70.47,135.3 70.73,135.03 74.19,135.03 75.46,133.76 STM32.89 75.46,118.82 v75.71,118.31 | STM32.47 70.46,135.3 70.47,135.3 | 73.29,64.14 75.65,66.5 v75.65,71.82
  Top 0.305: SJ1.1 63.41,54.32 63.75,54.66 73.29,64.14
  Bottom 0.305: v75.71,118.31 75.8,118.15 75.81,117.94 75.81,71.98 v75.65,71.82
RESET  (via drill 0.3)
  Top 0.254: STM32.14 85.52,129 86.41,129.93 88.91,129.94
  Top 0.305: 88.91,129.94 88.91,128.34 v89.37,127.89 | v90.64,160.49 109.06,160.49 113.14,164.57 R3.1 113.14,165.67 | RESET.3 RESET.1 111.56,171.58 111.56,167.26 113.14,165.67 | 113.14,165.67 113.14,166.44 113.63,166.93 117.76,166.93 C2.1
  Bottom 0.305: v89.37,127.89 89.37,159.22 v90.64,160.49
RX1
  Top 0.254: RS232.3 140.95,167.58 141.29,167.24 141.29,165.66 142.34,164.6 142.34,161.36 144.26,159.45 U1.13
TX1
  Top 0.254: U1.14 145.53,160.98 144.88,161.62 144.88,164.72 145.52,165.35 145.52,169.96 146.03,170.47 | RS232.1 146.14,170.65
  Top 0.305: 146.03,170.47 RS232.1
VBAT
  Top 0.254: 90.66,125.78 R2.1 90.62,125.78 86.28,125.78 | 94.09,125.8 C1.+
  Top 0.305: STM32.6 85.5,125 86.28,125.78
  Top 0.406: R2.1 94.02,125.77 C1.+
VCAP1
  Top 0.254: STM32.49 69.46,140.91 C3.1
VCAP2
  Top 0.254: 62.73,123.5 STM32.73
  Top 0.305: 62.73,123.5 61.31,124.91 60.36,124.91 C4.1
VDDA
  Top 0.305: STM32.22 84.58,133 85.35,133.77 85.35,136.18 C16.1
  Top 0.406: C16.1 89.85,137.55 91.43,139.13 R8.2 | 92.48,139.43 R8.2 | R8.2 107.93,139.12 C15.1 111.86,139.03 L1.2
VIN
  Top 0.813: 231.8,53.41 IC2.5
  Top 1.27: 231.8,53.41 C36.1
  Top 1.778: D3.C 202.35,44.89 203.98,46.52 | C39.+ 226.76,58.77 226.81,58.72
  Top 1.93: C38.1 228.33,49.71 228.33,52.08 230.83,52.08 230.83,53.08 231.8,53.41
  Top 3.81: 230.83,53.08 230.83,56.96 226.83,56.96 226.81,56.97 | J1.1 178.49,47.97 180.91,45.55 203.01,45.55 203.98,46.52 205.38,47.92 | 205.38,47.92 205.38,53.21 PWR.1 | 205.38,47.92 205.38,47.83 207.84,45.46 215.54,45.46 217.49,47.49 217.49,51.47 | 217.49,51.47 217.66,51.22 | 217.49,51.47 222.99,56.97 226.81,56.97 | 226.81,56.97 226.81,58.72
VREF
  Top 0.254: STM32.21 84.86,132.5 C14.1 89.57,134.91 R8.1 | 95.76,137.82 C13.1
  Top 0.305: R8.1 92.6,137.34 C13.1

### Text on the board
tNames: GND | RX | TX | C31 | R29 | R30 | R28 | C33 | C30 | C32 | R33 | R19 | R18 | R21 | R22 | R23 | R24 | R25 | R26 | C34 | C3 | + | + | + | C7 | + | C14 | C4 | + | C10 | + | + | +3V3 | CLK | GND | DIO | COLORPRISM XL 192x64 | C12 | R4 | + | R11 | C19 | C35 | C17 | R9 | R13 | C21 | 12V | + | - | C29 | R27 | R14 | C26 | C41 | C18 | R10 | R12 | C20 | C40 | GND | +18V | EVO XL 192X64 BOARD REV 1.3 / (C) 2026 WWW.PIN2DMD.COM
bNames: - | + | - | + | - | +
200bmp: F:/pcbs/Frames/192x64uni.bmp